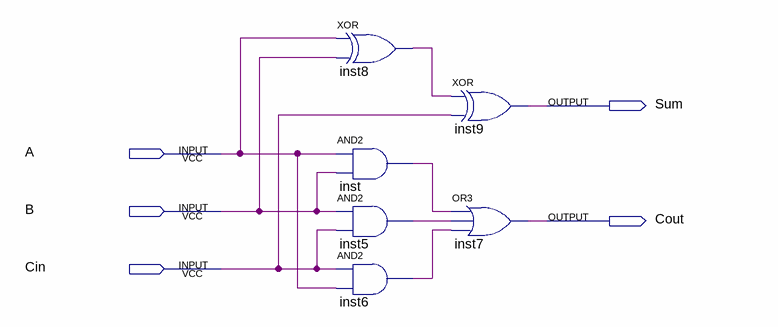
[diagram p0: schematic sheet]
// Quartus schematic Full_Adder.bdf as structural Verilog: 6 symbols, 5 pins
module Full_Adder (
  input  A,
  input  B,
  input  Cin,
  output Sum,
  output Cout
);

  wire inst5_out, inst6_out, inst8_out, inst_out;

  xor inst8 (inst8_out, A, B);
  and inst (inst_out, A, B);
  and inst5 (inst5_out, B, Cin);
  and inst6 (inst6_out, Cin, A);
  xor inst9 (Sum, inst8_out, Cin);
  or inst7 (Cout, inst_out, inst5_out, inst6_out);
endmodule
